# EAGLE design BigClock (EAGLE 6.1)
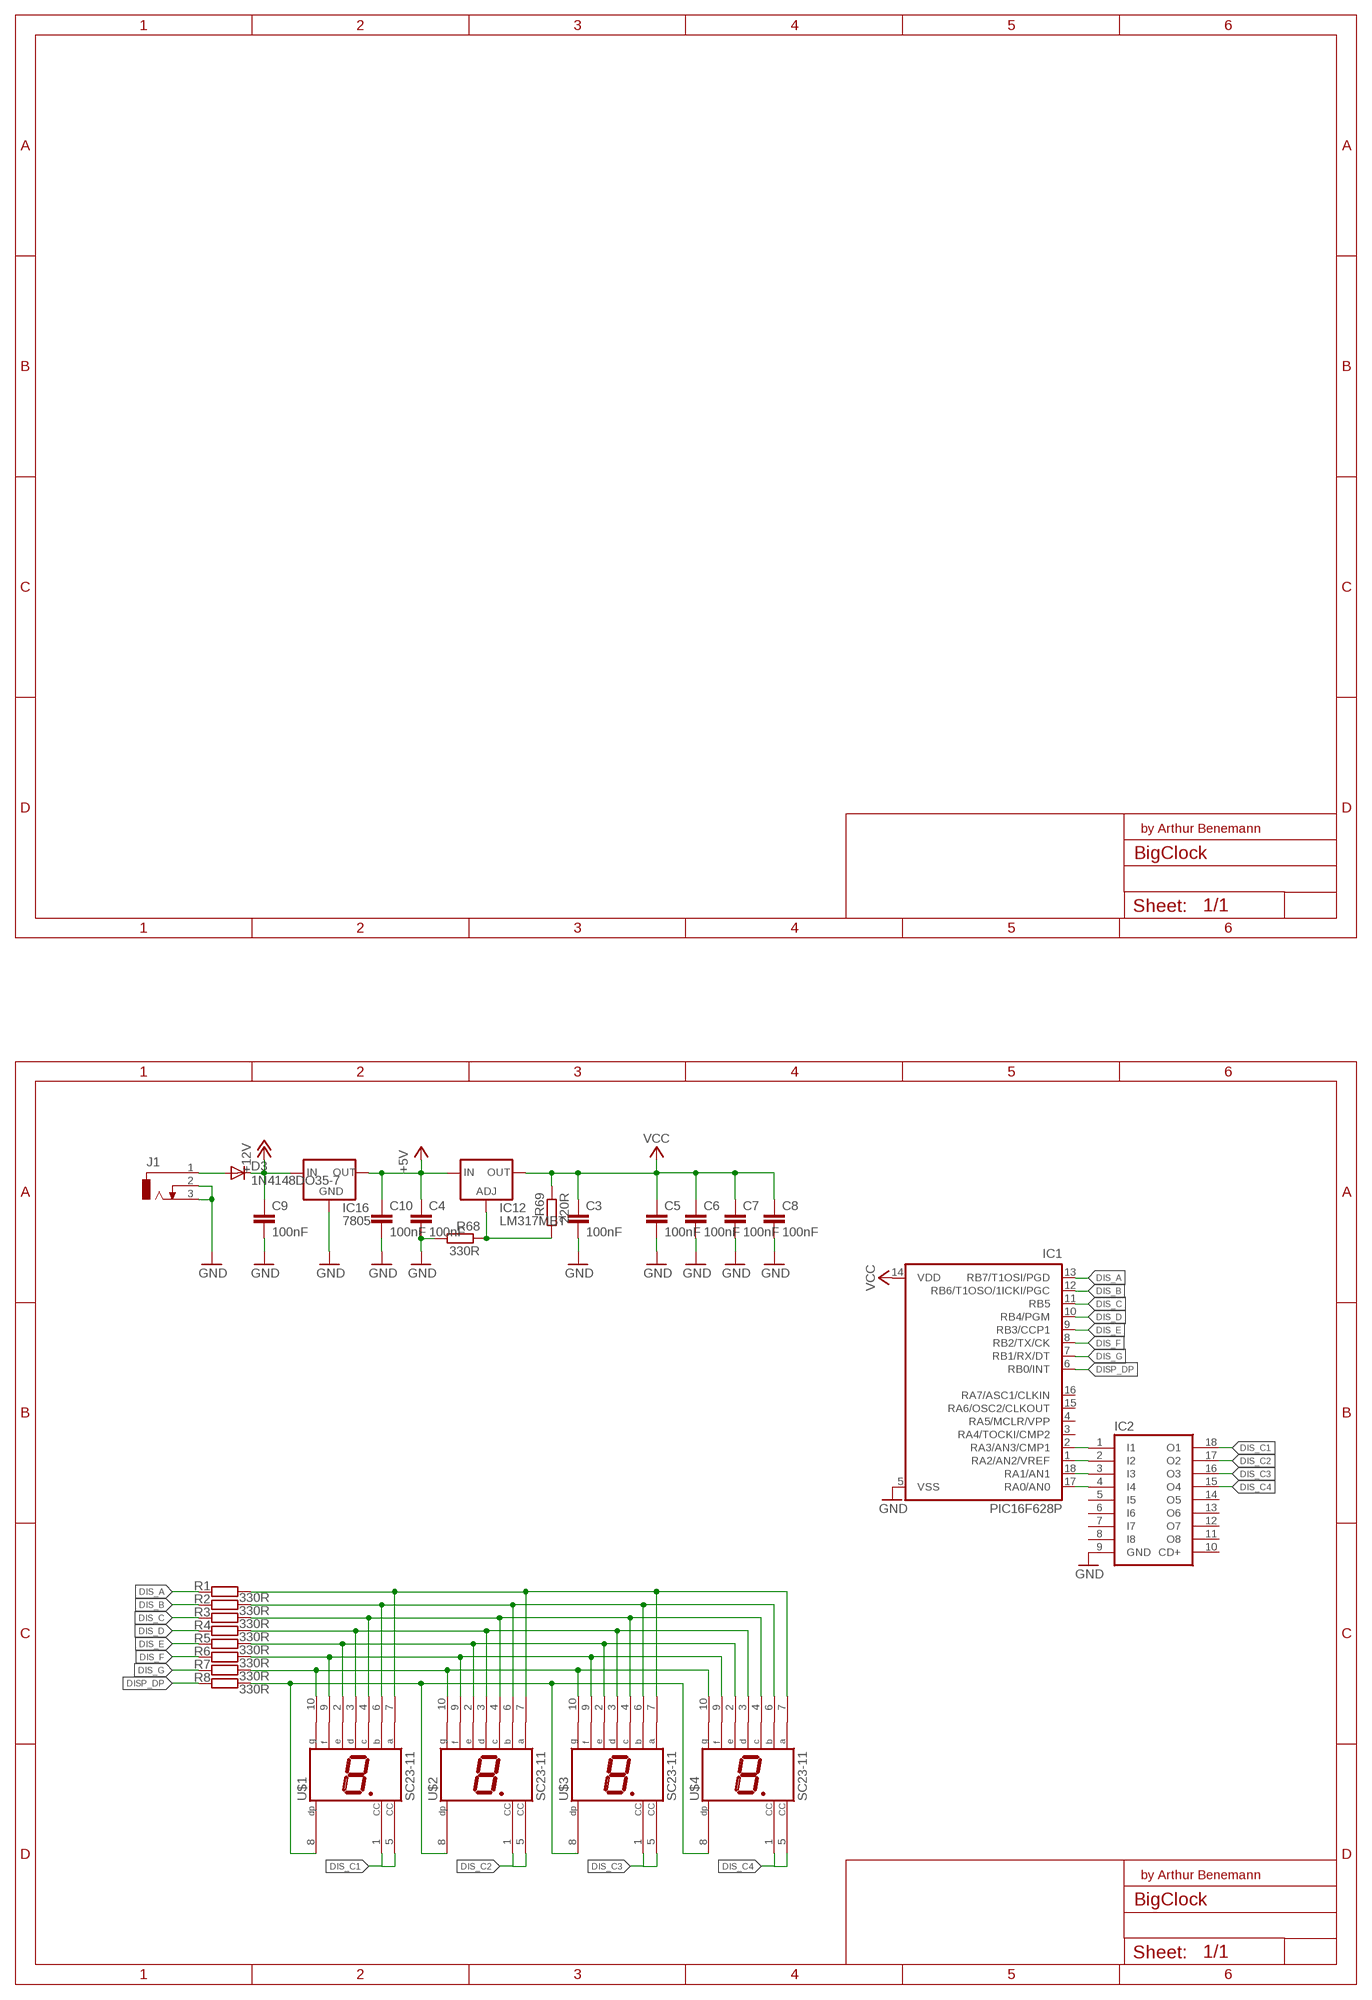
[diagram p0: schematic, sheet 1]

## Parts
C3  100nF  C-EU050-025X075  [C050-025X075]
C4  100nF  C-EU050-025X075  [C050-025X075]
C5  100nF  C-EU050-025X075  [C050-025X075]
C6  100nF  C-EU050-025X075  [C050-025X075]
C7  100nF  C-EU050-025X075  [C050-025X075]
C8  100nF  C-EU050-025X075  [C050-025X075]
C9  100nF  C-EU050-025X075  [C050-025X075]
C10  100nF  C-EU050-025X075  [C050-025X075]
D3  1N4148DO35-7  [DO35-7]
IC1  PIC16F628P  [DIL18]
IC2  ULN2803A  [DIL18]
IC12  LM317MBT  [TO220L1]
IC16  7805  78XXL  [78XXL]
J1  DCJ0303  [DCJ0303]
R1  330R  R-EU_0204/5  [0204/5]
R2  330R  R-EU_0204/5  [0204/5]
R3  330R  R-EU_0204/5  [0204/5]
R4  330R  R-EU_0204/5  [0204/5]
R5  330R  R-EU_0204/5  [0204/5]
R6  330R  R-EU_0204/5  [0204/5]
R7  330R  R-EU_0204/5  [0204/5]
R8  330R  R-EU_0204/5  [0204/5]
R68  330R  R-EU_0204/5  [0204/5]
R69  220R  R-EU_0204/5  [0204/5]
U$1  SC23-11  [SX23-XX]
U$2  SC23-11  [SX23-XX]
U$3  SC23-11  [SX23-XX]
U$4  SC23-11  [SX23-XX]

## Nets
+5V: C4.1 C10.1 IC12.3(IN) IC16.OUT
+12V: C9.1 D3.C IC16.IN
DIS_A: IC1.13(RB7/T1OSI/PGD) R1.2
DIS_B: IC1.12(RB6/T1OSO/1ICKI/PGC) R2.2
DIS_C: IC1.11(RB5) R3.2
DIS_C1: IC2.18(O1) U$1.1(CC) U$1.5(CC)
DIS_C2: IC2.17(O2) U$2.1(CC) U$2.5(CC)
DIS_C3: IC2.16(O3) U$3.1(CC) U$3.5(CC)
DIS_C4: IC2.15(O4) U$4.1(CC) U$4.5(CC)
DIS_D: IC1.10(RB4/PGM) R4.2
DIS_E: IC1.9(RB3/CCP1) R5.2
DIS_F: IC1.8(RB2/TX/CK) R6.2
DIS_G: IC1.7(RB1/RX/DT) R7.2
DISP_DP: IC1.6(RB0/INT) R8.2
GND: C3.2 C4.2 C5.2 C6.2 C7.2 C8.2 C9.2 C10.2 IC1.5(VSS) IC2.9(GND) IC16.GND J1.2 J1.3 R68.2
N$1: R8.1 U$1.8(DP) U$2.8(DP) U$3.8(DP) U$4.8(DP)
N$2: IC1.2(RA3/AN3/CMP1) IC2.1(I1)
N$3: IC1.1(RA2/AN2/VREF) IC2.2(I2)
N$4: IC1.18(RA1/AN1) IC2.3(I3)
N$5: IC1.17(RA0/AN0) IC2.4(I4)
N$31: R7.1 U$1.10(G) U$2.10(G) U$3.10(G) U$4.10(G)
N$32: R6.1 U$1.9(F) U$2.9(F) U$3.9(F) U$4.9(F)
N$33: R5.1 U$1.2(E) U$2.2(E) U$3.2(E) U$4.2(E)
N$34: R4.1 U$1.3(D) U$2.3(D) U$3.3(D) U$4.3(D)
N$35: R3.1 U$1.4(C) U$2.4(C) U$3.4(C) U$4.4(C)
N$36: R2.1 U$1.6(B) U$2.6(B) U$3.6(B) U$4.6(B)
N$37: R1.1 U$1.7(A) U$2.7(A) U$3.7(A) U$4.7(A)
N$70: D3.A J1.1
N$118: IC12.1(ADJ) R68.1 R69.2
VCC: C3.1 C5.1 C6.1 C7.1 C8.1 IC1.14(VDD) IC12.2(OUT) R69.1
Unconnected: IC1.3(RA4/TOCKI/CMP2) IC1.4(RA5/MCLR/VPP) IC1.15(RA6/OSC2/CLKOUT) IC1.16(RA7/ASC1/CLKIN) IC2.5(I5) IC2.6(I6) IC2.7(I7) IC2.8(I8) IC2.10(CD+) IC2.11(O8) IC2.12(O7) IC2.13(O6) IC2.14(O5)

## Notes on the sheet
- by Arthur Benemann
- by Arthur Benemann

## Library data of the parts
C3-C10 = rcl:C-EU: CAPACITOR, European symbol
D3 = diode:1N4148: DIODE high speed (Philips)
IC1 = microchip:PIC16*F62: FLASH-Based 8-Bit CMOS Microcontroller Source: http://ww1.microchip.com/downloads/en/DeviceDoc/40300C.pdf; MF: MICROCHIP; MPN: PIC16F628-20/P; OC_FARNELL: 9760423; OC_NEWARK: 23C4982
IC2 = uln-udn:ULN2803A: DRIVER ARRAY
IC12 = v-reg:LM317?*: 500 mA Adjustable Output Positive Voltage Regulator Source: http://www.onsemi.co.jp .. LM317M-D.PDF
IC16 = v-reg:78XXL: VOLTAGE REGULATOR
J1 = con-jack:DCJ0303: DC POWER JACK Source: DCJ0303.pdf
R1-R8 R68 R69 = rcl:R-EU_: RESISTOR, European symbol
U$1-U$4 = display-kingbright:SC23-11: LED DISPLAY 1-character 7 segment, decimal point right

## Board
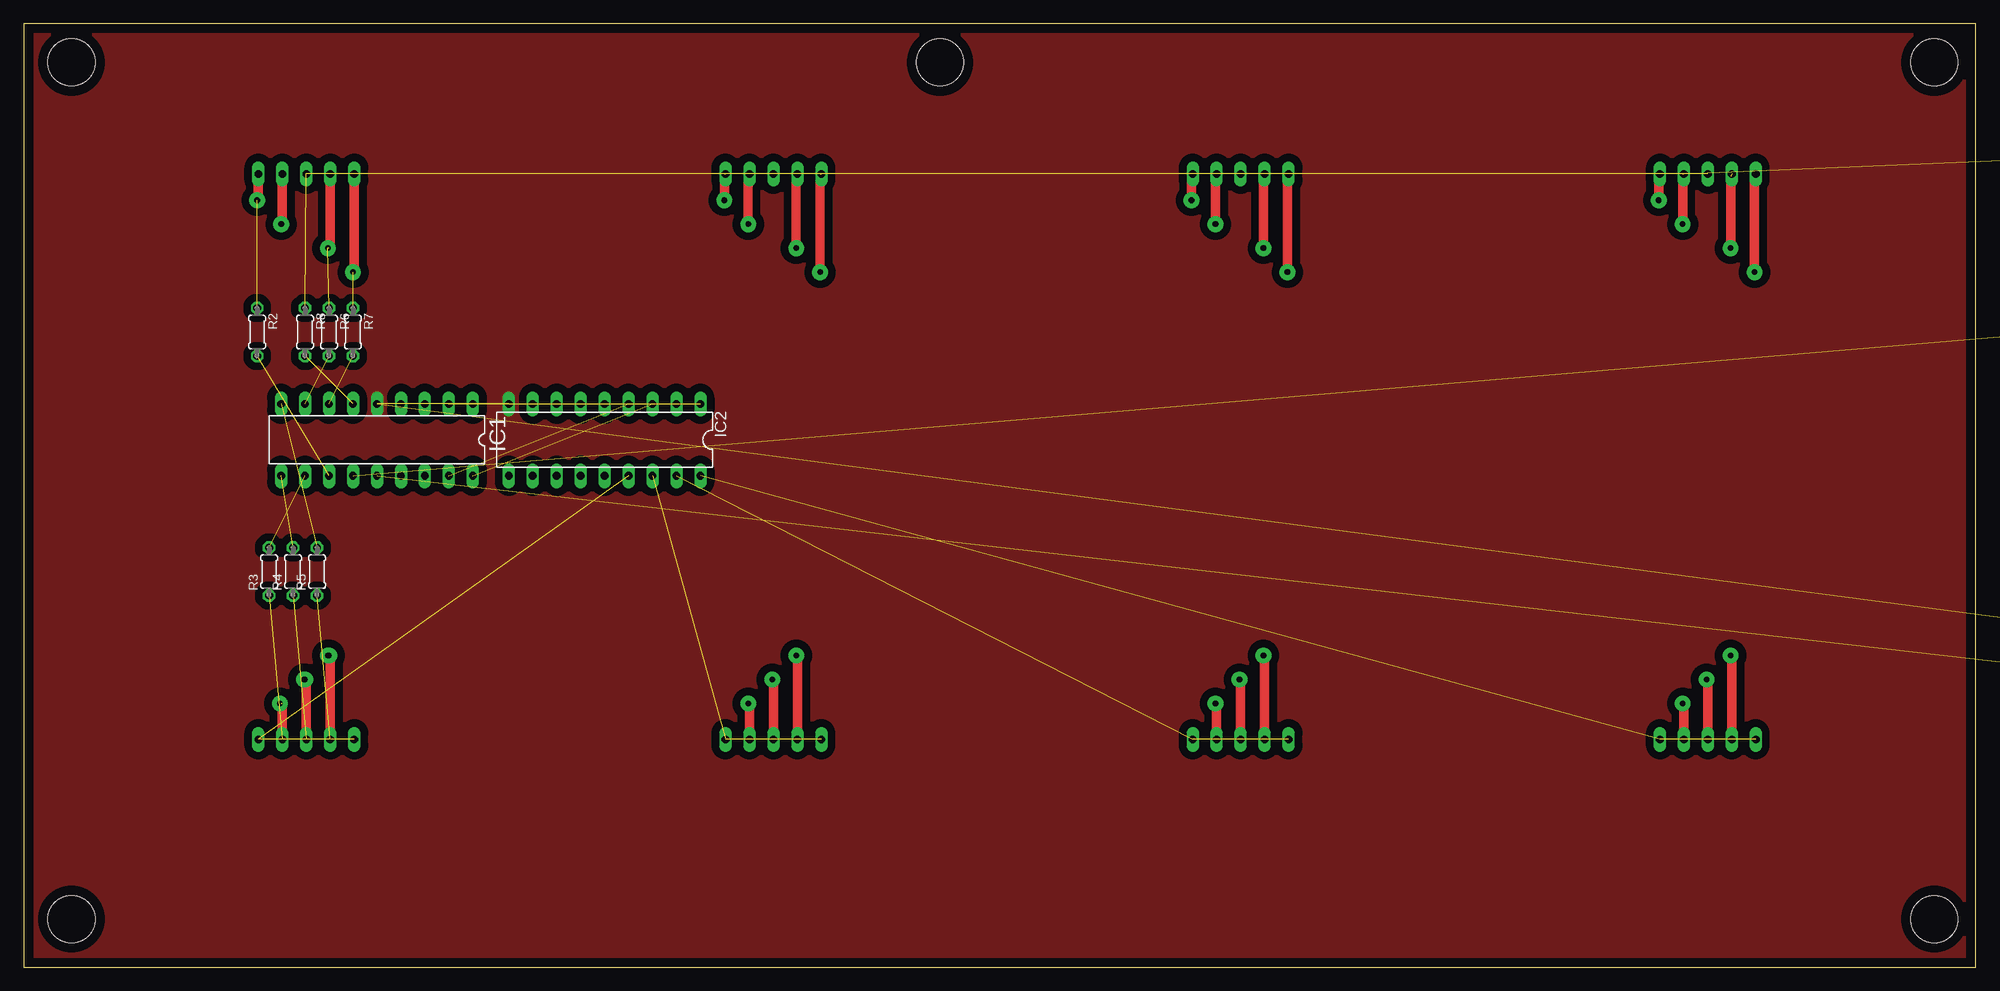
[diagram p1: board, top side]
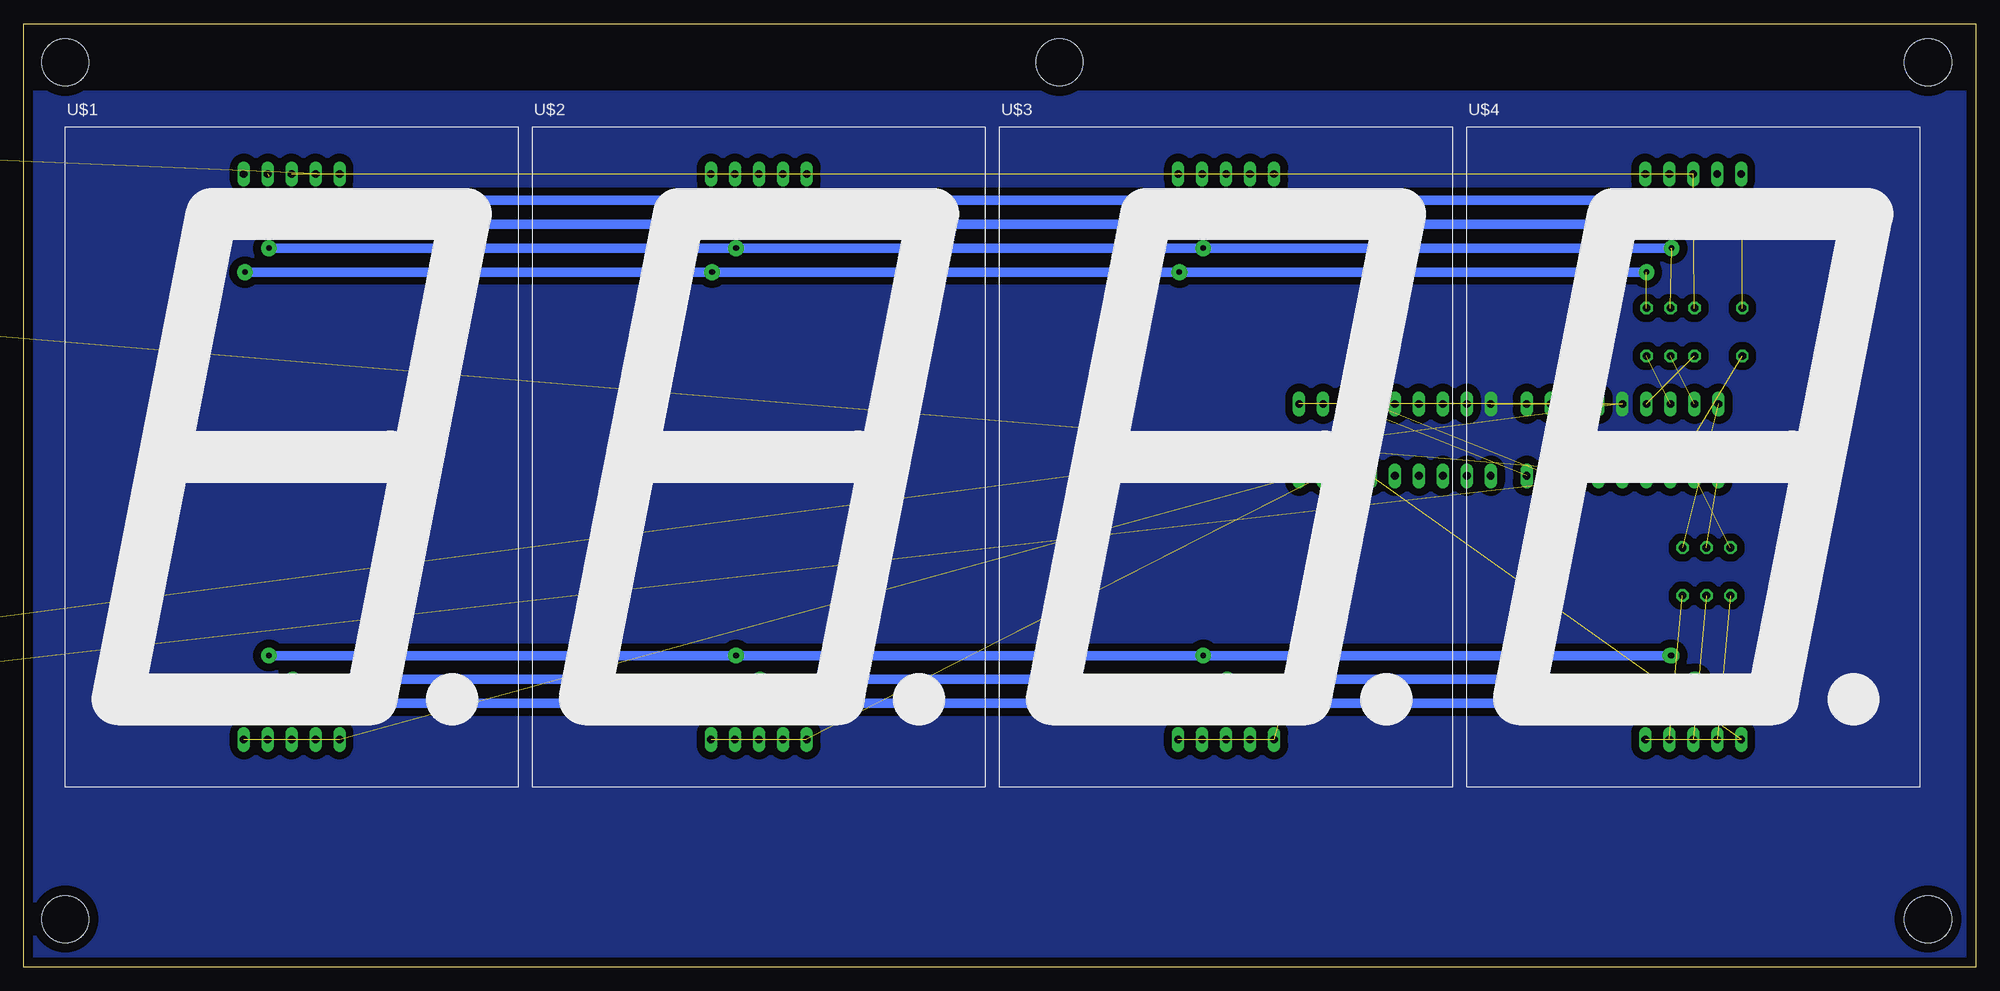
[diagram p2: board, bottom side, seen from below]

Size 206.99 x 100 mm. Coordinates in mm from the lower left corner, seen from the top.
Outline: 206.99,0 206.99,100 0,100 0,0 206.99,0
Copper layers (1*16): Top 0.035mm / dielectric 1.5mm / Bottom 0.035mm
Design rules: minimum track width 10mil, minimum drill 20mil, track to track 15mil, track to pad 16mil, pad to pad 16mil, via to via 16mil, smd to smd 8mil, copper to edge 40mil, drill to drill 8mil, minimum pad ring 10mil, minimum via ring 8mil, stop-mask expansion 4mil, vias tented up to drill 0mil, thermal gap 10mil
Holes 5 mm at 202.56,95.88 5.08,95.88 5.08,5.08 202.56,5.08 97.16,95.88

### Footprints (pad centres in the part's own frame; a part is rotated, then mirrored left to right if it is on the bottom)
C050-025X075 = drill 0.813 octagon: 1 -2.54,0; 2 2.54,0
DO35-7 = drill 0.813 long: A 3.81,0; C -3.81,0
DIL18 = drill 0.813 long: 1 -10.16,-3.81; 2 -7.62,-3.81; 3 -5.08,-3.81; 4 -2.54,-3.81; 5 0,-3.81; 6 2.54,-3.81; 7 5.08,-3.81; 8 7.62,-3.81; 9 10.16,-3.81; 10 10.16,3.81; 11 7.62,3.81; 12 5.08,3.81; 13 2.54,3.81; 14 0,3.81; 15 -2.54,3.81; 16 -5.08,3.81; 17 -7.62,3.81; 18 -10.16,3.81
TO220L1 = drill 1.016 long: 1 -2.54,-3.81; 2 0,-3.81; 3 2.54,-3.81 | hole 3.302: 0,11.176
78XXL = drill 1.016 long: GND 0,-3.81; IN -2.54,-3.81; OUT 2.54,-3.81 | hole 3.302: 0,11.176
DCJ0303 = drill 1 pad 2 long: 1 0,3.1; 2 4.8,0; 3 0,-3
0204/5 = drill 0.813 octagon: 1 -2.54,0; 2 2.54,0
SX23-XX = drill 0.813 long: 1 18.923,5.08; 2 21.463,5.08; 3 24.003,5.08; 4 26.543,5.08; 5 29.083,5.08; 6 29.083,65.024; 7 26.543,65.024; 8 24.003,65.024; 9 21.463,65.024; 10 18.923,65.024

### Placement (x,y rotation side)
C3  239.4,29.21 0 top  (outside the outline)
C4  343.53,40.64 270 top  (outside the outline)
C5  319.4,53.34 180 top  (outside the outline)
C6  288.93,52.7 90 top  (outside the outline)
C7  329.56,54.61 180 top  (outside the outline)
C8  302.89,53.34 180 top  (outside the outline)
C9  314.32,31.75 0 top  (outside the outline)
C10  255.91,19.05 0 top  (outside the outline)
D3  282.57,38.1 270 top  (outside the outline)
IC1  37.47,55.88 180 top
IC2  61.59,55.88 180 top
IC12  258.44,26.67 270 top  (outside the outline)
IC16  283.85,26.67 270 top  (outside the outline)
J1  271.14,41.27 0 bottom  (outside the outline)
R1  531.5,96.52 270 top  (outside the outline)
R2  24.77,67.31 270 top
R3  26.03,41.91 90 top
R4  28.58,41.91 90 top
R5  31.12,41.91 90 top
R6  32.39,67.31 270 top
R7  34.93,67.31 270 top
R8  29.84,67.31 270 top
R68  240.67,35.56 270 top  (outside the outline)
R69  249.56,48.26 90 top  (outside the outline)
U$1  202.56,19.05 0 bottom
U$2  153.04,19.05 0 bottom
U$3  103.51,19.05 0 bottom
U$4  53.97,19.05 0 bottom

### Tracks (layer width: path | path; a pad name or v marks a point on that pad's centre or on a via)
+5V  (3 unrouted)
+12V  (2 unrouted)
DIS_A  (1 unrouted)
DIS_B  (1 unrouted)
DIS_C  (1 unrouted)
DIS_C1  (2 unrouted)
DIS_C2  (2 unrouted)
DIS_C3  (2 unrouted)
DIS_C4  (2 unrouted)
DIS_D  (1 unrouted)
DIS_E  (1 unrouted)
DIS_F  (1 unrouted)
DIS_G  (1 unrouted)
DISP_DP  (1 unrouted)
GND  (13 unrouted)
  pour Top (isolate 0.813, no thermals): 207.65,100.33 207.65,0 -1.27,0 -1.27,100.33
  pour Bottom (isolate 0.813, no thermals): 0,92.71 -3.17,-2.54 208.92,-2.54 208.92,92.71
N$1  (4 unrouted)
N$2  (1 unrouted)
N$3  (1 unrouted)
N$4  (1 unrouted)
N$5  (1 unrouted)
N$31  (via drill 0.6 pad 1.68)  (2 unrouted)
  Top 1.016: 84.46,84.07 v84.46,73.66 | U$1.10 183.52,84.07 v183.52,73.66 | U$2.10 133.99,84.07 v133.99,73.66 | U$4.10 35.05,73.66 v34.93,73.66
  Bottom 1.016: v34.93,73.66 v84.46,73.66 v133.99,73.66 v183.52,73.66
N$32  (via drill 0.6 pad 1.68)  (5 unrouted)
  Top 1.016: 81.92,84.07 v81.92,76.2 | 131.44,84.07 v131.44,76.2 | v180.98,76.2 180.98,83.82 | U$4.9 32.51,76.2 v32.26,76.2
  Bottom 1.016: v180.98,76.2 v131.44,76.2 v81.92,76.2 32.39,76.2
N$33  (via drill 0.6, 0.6 pad 1.68)  (1 unrouted)
  Top 1.016: 180.85,33.02 v180.98,33.02 181.1,33.02 U$1.2 | 131.32,33.02 v131.44,33.02 131.57,33.02 U$2.2 | 81.79,33.02 v81.92,33.02 82.04,33.02 U$3.2 | v32.26,33.02 v32.39,33.02 32.51,33.02 U$4.2
  Bottom 1.016: v180.98,33.02 v131.44,33.02 v81.92,33.02 v32.39,33.02
N$34  (via drill 0.6, 0.6 pad 1.68)  (1 unrouted)
  Top 1.016: 178.31,30.48 v178.44,30.48 178.56,30.48 U$1.3 | 128.78,30.48 v128.91,30.48 129.03,30.48 U$2.3 | 79.25,30.48 v79.38,30.48 79.5,30.48 U$3.3 | v29.84,30.48 v29.72,30.48 29.97,30.48 U$4.3
  Bottom 1.016: v178.44,30.48 v128.91,30.48 v79.38,30.48 v29.84,30.48
N$35  (via drill 0.6 pad 1.68)  (2 unrouted)
  Top 1.016: U$4.4 27.43,27.94 v27.18,27.94 | v76.84,27.94 76.96,27.94 U$3.4 | v126.37,27.94 126.49,27.94 U$2.4 | v175.9,27.94 176.02,27.94 U$1.4
  Bottom 1.016: v175.9,27.94 v126.37,27.94 v76.84,27.94 27.31,27.94
N$36  (via drill 0.6 pad 1.68)  (4 unrouted)
  Top 1.016: v173.36,81.28 173.36,84.07 | 74.3,84.07 v74.3,81.28 | 123.83,84.07 v123.83,81.28 | U$4.6 24.89,81.28 v24.77,81.28
  Bottom 1.016: v24.77,81.28 v74.3,81.28 v123.83,81.28 v173.36,81.28
N$37  (via drill 0.6 pad 1.68)  (3 unrouted)
  Top 1.016: v175.9,78.74 175.9,84.07 | 126.37,84.07 v126.37,78.74 | v76.84,78.74 76.84,83.82 76.96,83.82 U$3.7 | U$4.7 27.43,78.74 v27.31,78.74
  Bottom 1.016: v27.31,78.74 v76.84,78.74 v126.37,78.74 v175.9,78.74
N$70  (1 unrouted)
N$118  (2 unrouted)
VCC  (7 unrouted)